# Altium schematic sheet Sheet1.SchDoc
size A
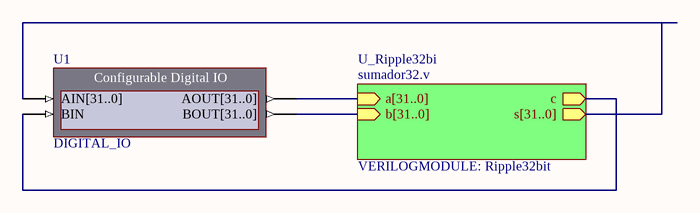
[diagram p0: Sheet1.SchDoc]

## Parts
U1  DIGITAL_IO

## Sub-sheets
U_Ripple32bi = sumador32.v: a[31..0] (in), b[31..0] (in), c (out), s[31..0] (out)  | VERILOGMODULE: Ripple32bit

## Nets
NetU1_AIN[31..0]: U1.AIN[31..0] ; sheet U_Ripple32bi/s[31..0]
NetU1_AOUT[31..0]: U1.AOUT[31..0] ; sheet U_Ripple32bi/a[31..0]
NetU1_BIN: U1.BIN ; sheet U_Ripple32bi/c
NetU1_BOUT[31..0]: U1.BOUT[31..0] ; sheet U_Ripple32bi/b[31..0]

## Library data of the parts
U1 = DIGITAL_IO: Configurable Digital IO; NEXUS_CORE: Instrument; NEXUS_JTAG_DEVICE: True; NEXUS_JTAG_ORDER: 0; ConfigurationParameters: {}Version[2.0]{}StorageType[3]{}InterfaceType[Parallel]{}SchCompWidth[140]{}Input0Name[AIN{1}31..0{2}]{}Input0Width[32]{}Input0InitValue[0]{}Input0Kind[Numeric]{}Input0NumRadix[Decimal]{}Input1Name[BIN]{}Input1Width[1]{}Input1InitValue[0]{}Input1Kind[LEDs]{}Input1LEDStyle[Red]{}Output0Name[AOUT{1}31..0{2}]{}Output0Width[32]{}Output0InitValue[0]{}Output0Kind[Numeric]{}Output0NumRadix[Decimal]{}Output1Name[BOUT{1}31..0{2}]{}Output1Width[32]{}Output1InitValue[0]{}Output1Kind[Numeric]{}Output1NumRadix[Decimal]{}Designator[U1]{}InternalID[0]{}; ConfiguratorName: DIGITAL_IO; ComponentLink1Description: Core &Resource Usage; ComponentLink1URL: CR0134 FPGA Instrument Resource Usage.pdf; Core Revision: 1.00.00; HelpURL: https://wiki.altium.com/display/ADOH/Digital+IO+Module; LastRevisionNo: 1.00.00; Published: 28-Jun-2007; Publisher: Altium Limited; UseInDSF: True